# EasyEDA Pro project Gateway.eprj

# Schematic Schematic1
Board Name: Board1; Create Date: 2025-09-13; Page Name: P1; Project Name: Gateway; Schematic Name: Schematic1; Update Date: 2025-09-13; Company: EasyEDA.com; Page Size: A4; Version: V1.0
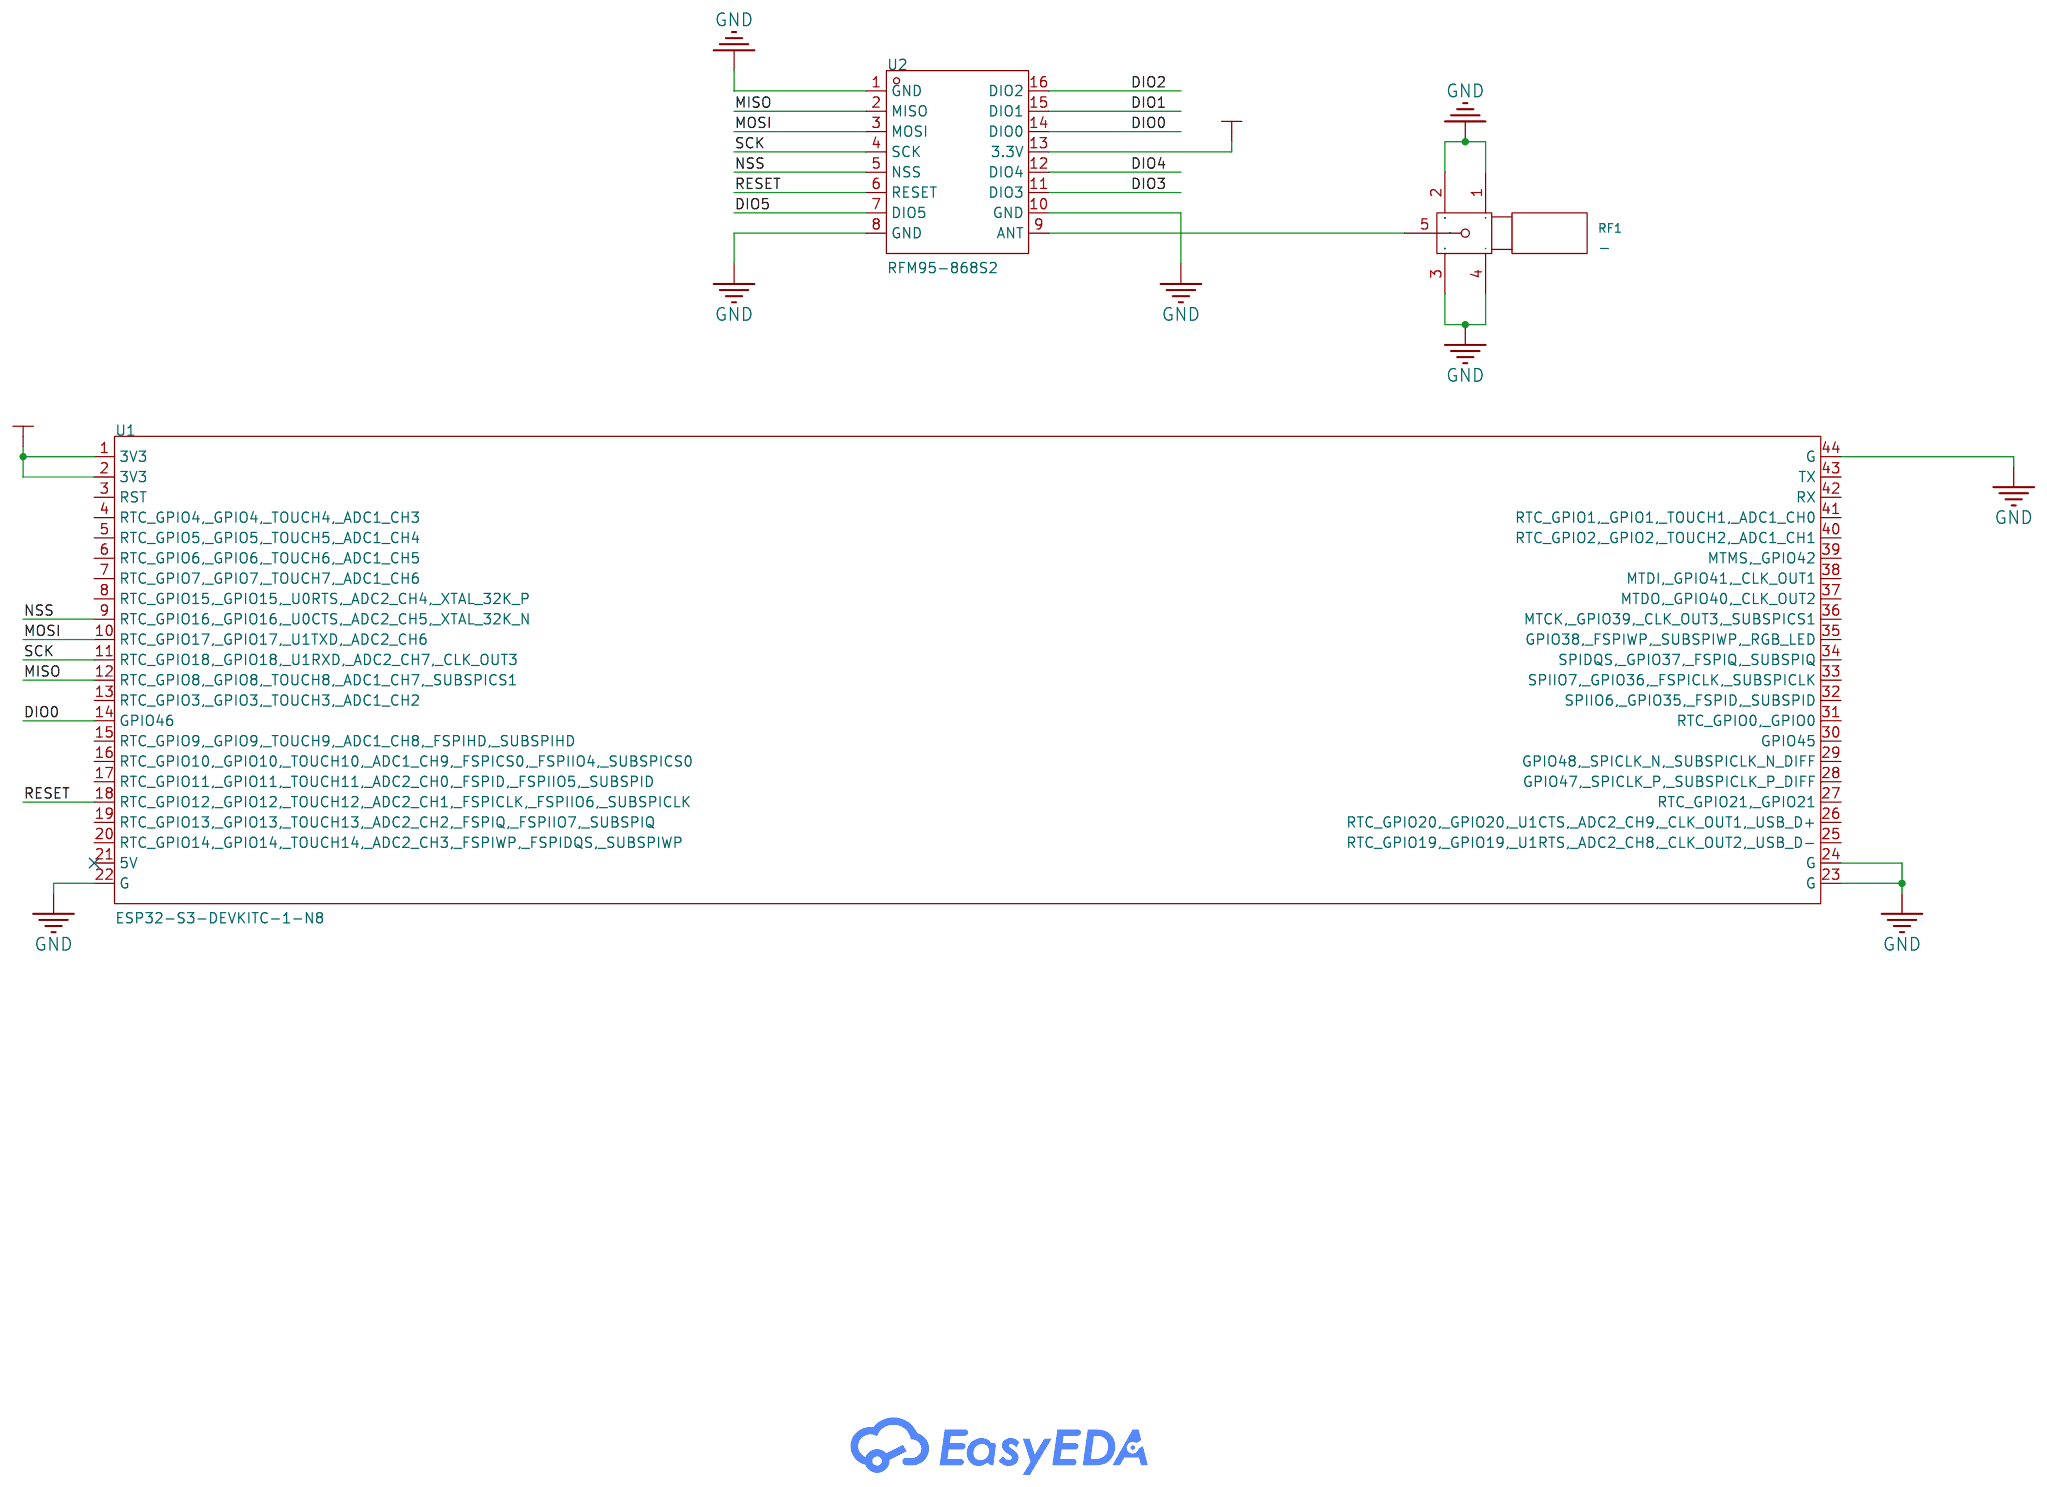
[diagram p0: schematic sheet]

## Parts
RF1  -  [SMA-TH_BWSMA-KWE-Z001]
U1  ESP32-S3-DEVKITC-1-N8  [CONN-TH_ESP32-S3-DEVKITC-1U-N8]
U2  RFM95-868S2  [WIRELM-SMD_RFM95-868S2]

## Library data of the parts
RF1 = BWSMA-KWE-Z001: LCSC Part Name: 内孔 SMA 弯头; Supplier Part: C496551; Manufacturer: BAT WIRELESS(蝙蝠无线); Supplier Footprint: 插件; JLCPCB Part Class: Extended Part; Datasheet: https://item.szlcsc.com/datasheet/BWSMA-KWE-Z001/508500.html; Supplier: LCSC; Connector Type: Board Side; Interface: Inner Bore; Number of Ports: 1; Interface Diameter: 5.3mm; RF Series: SMA; Impedance: 50Ω; Style: Elbow
U1 = ESP32-S3-DEVKITC-1-N8: Supplier Part: C20438410; Manufacturer: ESPRESSIF(乐鑫); JLCPCB Part Class: Extended Part; Supplier: LCSC
U2 = RFM95-868S2: Supplier Part: C22371063; Manufacturer: HOPERF(华普微电子); Supplier Footprint: SMD,16x16mm; JLCPCB Part Class: Extended Part; Datasheet: https://atta.szlcsc.com/upload/public/pdf/source/20240327/277022EA18EABF92C9EFA8B4B0106541.pdf; Supplier: LCSC

## Nets
+3V3: U1.1(3V3) U1.2(3V3) U2.13(3.3V)
GND: RF1.1 RF1.2 RF1.3 RF1.4 U1.22(G) U1.23(G) U1.24(G) U1.44(G) U2.1(GND) U2.8(GND) U2.10(GND)
DIO0: U1.14(GPIO46) U2.14(DIO0)
DIO1: U2.15(DIO1)
DIO2: U2.16(DIO2)
DIO3: U2.11(DIO3)
DIO4: U2.12(DIO4)
DIO5: U2.7(DIO5)
MISO: U1.12(RTC_GPIO8, GPIO8, TOUCH8, ADC1_CH7, SUBSPICS1) U2.2(MISO)
MOSI: U1.10(RTC_GPIO17, GPIO17, U1TXD, ADC2_CH6) U2.3(MOSI)
NSS: U1.9(RTC_GPIO16, GPIO16, U0CTS, ADC2_CH5, XTAL_32K_N) U2.5(NSS)
RESET: U1.18(RTC_GPIO12, GPIO12, TOUCH12, ADC2_CH1, FSPICLK, FSPIIO6, SUBSPICLK) U2.6(RESET)
SCK: U1.11(RTC_GPIO18, GPIO18, U1RXD, ADC2_CH7, CLK_OUT3) U2.4(SCK)
Net-(RF1-5): RF1.5 U2.9(ANT)

Not connected (* = marked no-connect by the designer): U1 3(RST) 4(RTC_GPIO4, GPIO4, TOUCH4, ADC1_CH3) 5(RTC_GPIO5, GPIO5, TOUCH5, ADC1_CH4) 6(RTC_GPIO6, GPIO6, TOUCH6, ADC1_CH5) 7(RTC_GPIO7, GPIO7, TOUCH7, ADC1_CH6) 8(RTC_GPIO15, GPIO15, U0RTS, ADC2_CH4, XTAL_32K_P) 13(RTC_GPIO3, GPIO3, TOUCH3, ADC1_CH2) 15(RTC_GPIO9, GPIO9, TOUCH9, ADC1_CH8, FSPIHD, SUBSPIHD) 16(RTC_GPIO10, GPIO10, TOUCH10, ADC1_CH9, FSPICS0, FSPIIO4, SUBSPICS0) 17(RTC_GPIO11, GPIO11, TOUCH11, ADC2_CH0, FSPID, FSPIIO5, SUBSPID) 19(RTC_GPIO13, GPIO13, TOUCH13, ADC2_CH2, FSPIQ, FSPIIO7, SUBSPIQ) 20(RTC_GPIO14, GPIO14, TOUCH14, ADC2_CH3, FSPIWP, FSPIDQS, SUBSPIWP) 21(5V)* 25(RTC_GPIO19, GPIO19, U1RTS, ADC2_CH8, CLK_OUT2, USB_D-) 26(RTC_GPIO20, GPIO20, U1CTS, ADC2_CH9, CLK_OUT1, USB_D+) 27(RTC_GPIO21, GPIO21) 28(GPIO47, SPICLK_P, SUBSPICLK_P_DIFF) 29(GPIO48, SPICLK_N, SUBSPICLK_N_DIFF) 30(GPIO45) 31(RTC_GPIO0, GPIO0) 32(SPIIO6, GPIO35, FSPID, SUBSPID) 33(SPIIO7, GPIO36, FSPICLK, SUBSPICLK) 34(SPIDQS, GPIO37, FSPIQ, SUBSPIQ) 35(GPIO38, FSPIWP, SUBSPIWP, RGB LED) 36(MTCK, GPIO39, CLK_OUT3, SUBSPICS1) 37(MTDO, GPIO40, CLK_OUT2) 38(MTDI, GPIO41, CLK_OUT1) 39(MTMS, GPIO42) 40(RTC_GPIO2, GPIO2, TOUCH2, ADC1_CH1) 41(RTC_GPIO1, GPIO1, TOUCH1, ADC1_CH0) 42(RX) 43(TX)

# Board PCB1
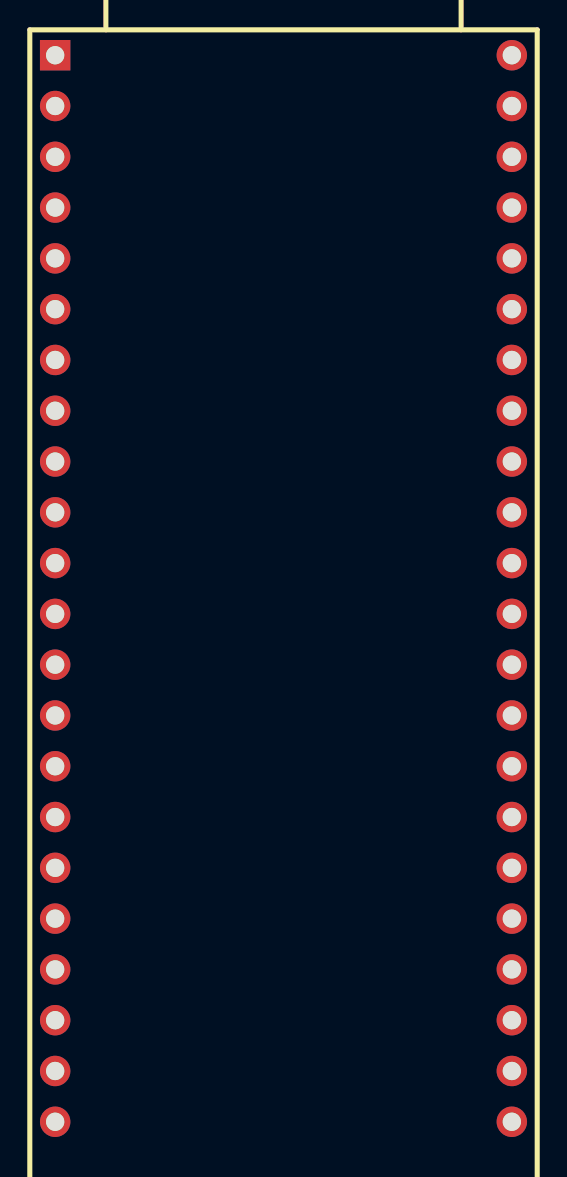
[diagram p1: board, top side]
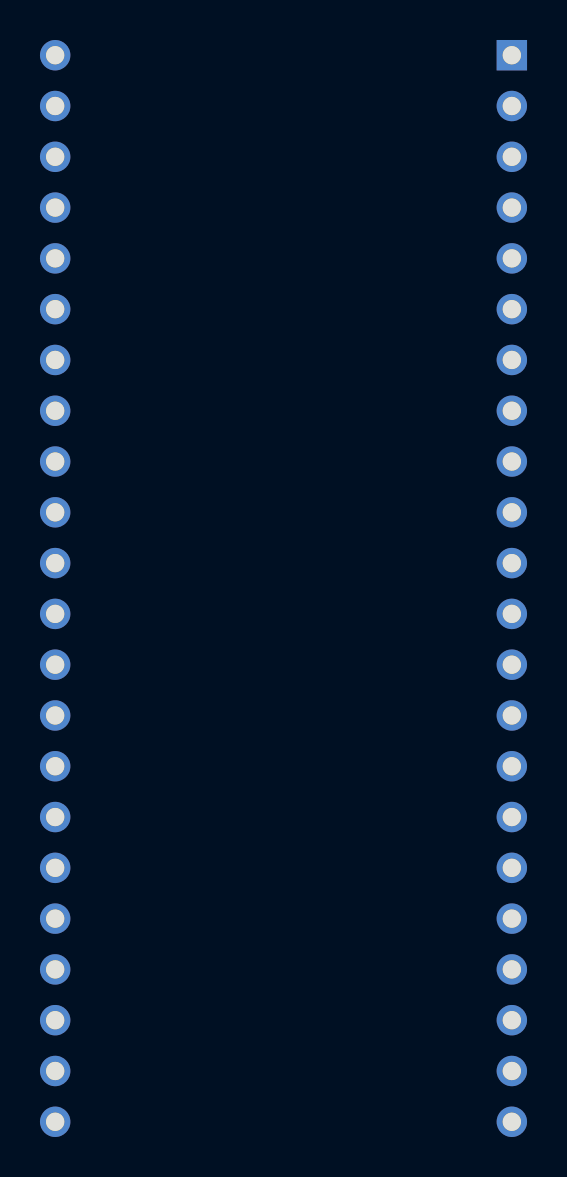
[diagram p2: board, bottom side, seen from below]

No outline. copper layers: Top Layer, Bottom Layer. Coordinates in mm from the lowest, leftmost part position.
Stack: Top Layer 0.035mm / Dielectric1 1.51mm FR4 er 4.5 / Bottom Layer 0.035mm

## Design rules (mm)
template: JLCPCB Capability(Two Layers Board)
spacing copperThickness1oz (default): track to track 0.102, other pairs 0.152 to 0.3
spacing copperThickness2oz: track to track 0.203, other pairs 0.152 to 0.3
track width copperThickness1oz (default): min 0.127, default 0.254, max 2.54
track width copperThickness2oz: min 0.203, default 0.254, max 2.54
differential pair differentialPair (default): width min 0.127, default 0.254, max 2.54; gap min 0.152, default 0.152
via viaSize (default): diameter min 0.5, default 0.61, max 10; hole min 0.3, default 0.305, max 6.3

## Placement (name value [footprint] x y rotation side)
U1  ESP32-S3-DEVKITC-1-N8  [CONN-TH_ESP32-S3-DEVKITC-1U-N8]  0 0 0 top

## Footprints (pads in the part's own frame, mm; a bottom-side part is the same pattern mirrored in y, then rotated)
CONN-TH_ESP32-S3-DEVKITC-1U-N8
  rect 1.524x1.524 hole 0.914: 1(-11.43,26.67)
  round 1.524 hole 0.914: 2(-11.43,24.13) 3(-11.43,21.59) 4(-11.43,19.05) 5(-11.43,16.51) 6(-11.43,13.97) 7(-11.43,11.43) 8(-11.43,8.89) 9(-11.43,6.35) 10(-11.43,3.81) 11(-11.43,1.27) 12(-11.43,-1.27) 13(-11.43,-3.81) 14(-11.43,-6.35) 15(-11.43,-8.89) 16(-11.43,-11.43) 17(-11.43,-13.97) 18(-11.43,-16.51) 19(-11.43,-19.05) 20(-11.43,-21.59) 21(-11.43,-24.13) 22(-11.43,-26.67) 23(11.43,-26.67) 24(11.43,-24.13) 25(11.43,-21.59) 26(11.43,-19.05) 27(11.43,-16.51) 28(11.43,-13.97) 29(11.43,-11.43) 30(11.43,-8.89) 31(11.43,-6.35) 32(11.43,-3.81) 33(11.43,-1.27) 34(11.43,1.27) 35(11.43,3.81) 36(11.43,6.35) 37(11.43,8.89) 38(11.43,11.43) 39(11.43,13.97) 40(11.43,16.51) 41(11.43,19.05) 42(11.43,21.59) 43(11.43,24.13) 44(11.43,26.67)

## Nets
As in the schematic.

Pads without a net: U1 1 2 3 4 5 6 7 8 9 10 11 12 13 14 15 16 17 18 19 20 21 22 23 24 25 26 27 28 29 30 31 32 33 34 35 36 37 38 39 40 41 42 43 44
